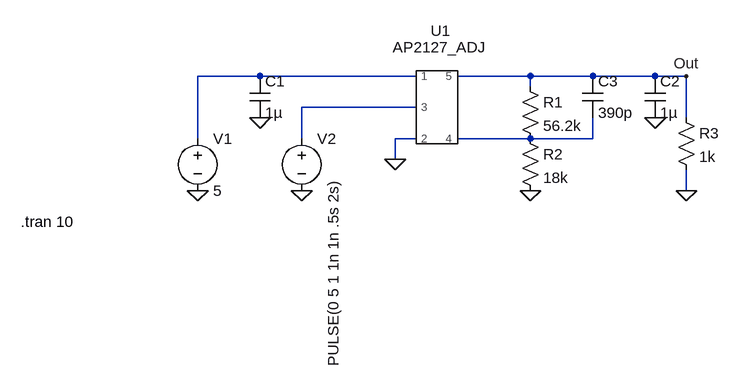
[diagram p0: schematic AP2127.asc]
AP2127.asc, the LTspice schematic file:
Version 4.1
SHEET 1 1248 720
WIRE 432 64 336 64
WIRE 672 64 432 64
WIRE 848 64 736 64
WIRE 944 64 848 64
WIRE 1040 64 944 64
WIRE 1088 64 1040 64
WIRE 848 80 848 64
WIRE 672 112 496 112
WIRE 1088 128 1088 64
WIRE 336 160 336 64
WIRE 496 160 496 112
WIRE 672 160 640 160
WIRE 848 160 736 160
WIRE 944 160 944 128
WIRE 944 160 848 160
WIRE 640 192 640 160
WIRE 1088 240 1088 208
FLAG 336 240 0
FLAG 496 240 0
FLAG 848 240 0
FLAG 1088 64 Out
FLAG 640 192 0
FLAG 1088 240 0
FLAG 432 128 0
FLAG 1040 128 0
SYMBOL voltage 336 144 R0
WINDOW 123 0 0 Left 0
WINDOW 39 0 0 Left 0
SYMATTR InstName V1
SYMATTR Value 5
SYMBOL voltage 496 144 R0
WINDOW 123 0 0 Left 0
WINDOW 39 0 0 Left 0
WINDOW 3 49 79 VRight 2
SYMATTR InstName V2
SYMATTR Value PULSE(0 5 1 1n 1n .5s 2s)
SYMBOL res 832 64 R0
SYMATTR InstName R1
SYMATTR Value 56.2k
SYMBOL res 832 144 R0
SYMATTR InstName R2
SYMATTR Value 18k
SYMBOL AP2127_ADJ 704 112 R0
WINDOW 0 6 -102 Bottom 2
WINDOW 3 4 -108 Top 2
SYMATTR InstName U1
SYMBOL res 1072 112 R0
SYMATTR InstName R3
SYMATTR Value 1k
SYMBOL cap 416 64 R0
SYMATTR InstName C1
SYMATTR Value 1µ
SYMBOL cap 1024 64 R0
SYMATTR InstName C2
SYMATTR Value 1µ
SYMBOL cap 928 64 R0
SYMATTR InstName C3
SYMATTR Value 390p
TEXT 64 288 Left 2 !.tran 10

The netlist it stands for:
* AP2127.asc
V1 N001 0 5
V2 N002 0 PULSE(0 5 1 1n 1n .5s 2s)
R1 Out N003 56.2k
R2 N003 0 18k
X§U1 N001 0 N002 N003 Out AP2127_ADJ  ; pins 1 2 3 4 5
R3 Out 0 1k
C1 N001 0 1µ
C2 Out 0 1µ
C3 Out N003 390p
.tran 10
.lib AP2127.spice.txt
.backanno
.end